# Altium schematic sheet RS-485.SchDoc
size 420 x 297 mm; DocumentNumber: АБВГ.123456.XXX Э3; SheetNumber: 4; SheetTotal: 4; PageSetup: Record=PageOptionsZCenterHorizontal=FalseZCenterVertical=FalseZPrintScale=0.95ZXCorrection=0.00ZYCorrection=0.00ZPrintKind=1ZBorderSize=5000000ZLeftOffset=0ZBottomOffset=0ZOrientation=1ZPaperLength=1000ZPaperWidth=1000ZScale=100ZPaperSource=15ZPrintQuality=600ZMediaType=1ZDitherType=10ZPaperKind=A4ZPrintScaleMode=1; DocumentCode: АБВГ.123456.XXX Э3
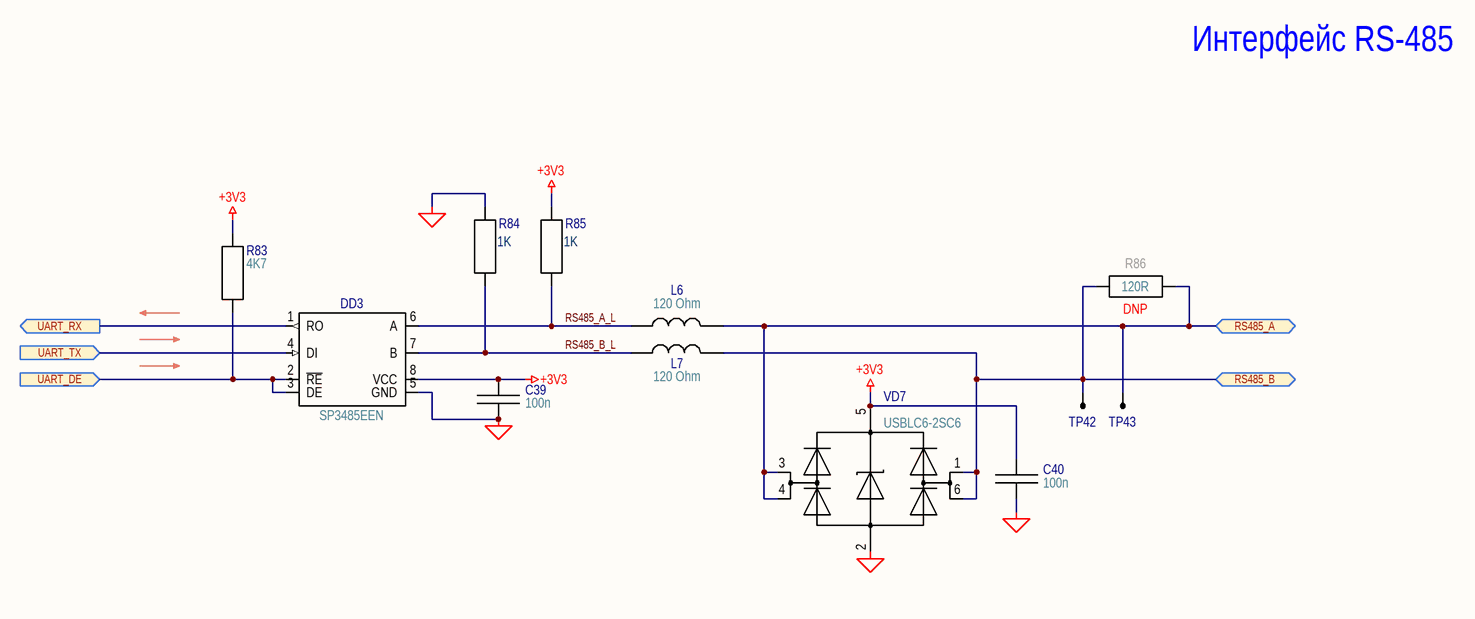
[diagram p0: RS-485.SchDoc]

## Parts
C39  100n  [C0402]
C40  100n  [C0402]
DD3  SP3485EEN  [SOP-8]
L6  120 Ohm  [BLM18PG]
L7  120 Ohm  [BLM18PG]
R83  4K7  [R0402]
R84  1K  [R0402]
R85  1K  [R0402]
R86  120R  [R0805_ROUNDED]  (no BOM)
TP42  TEST_POINT_1.27_STEP  [TEST_POINT_1.27_STEP]  (value not drawn)  (no BOM)
TP43  TEST_POINT_1.27_STEP  [TEST_POINT_1.27_STEP]  (value not drawn)  (no BOM)
VD7  USBLC6-2SC6  [SOT-23-6-USBLC-Internal-Jumpers]

## Ports
RS485_A (bidir, see Struct), RS485_B (bidir, see Struct), UART_DE (in, see Struct, MCU), UART_RX (out, see Struct, MCU), UART_TX (in, see Struct, MCU)

## Nets
+3V3: C39.2 C40.2 DD3.8(VCC) R83.2 R85.2 VD7.5
GND: C39.1 C40.1 DD3.5(GND) R84.2 VD7.2
RS485_A: L6.2 R86.2 TP43.1 VD7.3 VD7.4 ; port RS485_A
RS485_A_L: DD3.6(A) L6.1 R85.1
RS485_B: L7.2 R86.1 TP42.1 VD7.1 VD7.6 ; port RS485_B
RS485_B_L: DD3.7(B) L7.1 R84.1
UART_DE: DD3.2(~{RE}) DD3.3(DE) R83.1 ; port UART_DE
UART_RX: DD3.1(RO) ; port UART_RX
UART_TX: DD3.4(DI) ; port UART_TX

## Notes on the sheet
- Интерфейс RS-485
- (near R86) DNP
- Labels drawn without touching a wire or pin: =DocumentCode
- Подп. и дата
- Инв. № дубл.
- Взам. инв. №
- Инв. № подл.
- Лист
- Изм.
- № докум.
- Подп.
- Дата
- Копировал
- Формат А3

## Library data of the parts
C39 C40 = C0402: Чип-конденсатор 100 нФ 10% 50 В X7R 0402; Manufacturer Part Number: CC0402KRX7R9BB104; Manufacturer: Yageo; Value: 100 нФ 10% 50 В X7R; Component Type: Конденсатор
DD3 = SP3485EEN: Трансивер RS-485 SP3485EEN; Manufacturer: UMW; Manufacturer Part Number: SP3485EEN; Component Type: Микросхема
L6 L7 = BLM18PG121SN1D: Фильтр индуктивный 120 Ом @ 100 МГц 2 А 0603; Manufacturer: FENGHUA Advanced Technology; Manufacturer Part Number: CBM160808U121T; VALUE: 120 Ом @ 100 МГц 2 А; Component Type: Фильтр индуктивный
R83 = R0402: Чип-резистор 4,7 кОм 1% 0402; Manufacturer Part Number: RC0402FR-074K7L; Manufacturer: Yageo; Value: 4,7 кОм 1%; Component Type: Резистор
R84 R85 = R0402_4: Чип-резистор 1 кОм 1% 0402; Manufacturer Part Number: RC0402FR-071KL; Manufacturer: Yageo; Value: 1 кОм 1%; Component Type: Резистор
R86 = R0805: Чип-резистор 120 Ом 1% 0805; Manufacturer Part Number: RC0805FR-07120RL; Manufacturer: Yageo; TYPE: Чип-резистор 0805; Value: 120 Ом 1%; Component Type: Резистор
TP42 TP43 = TEST_POINT_1.27_STEP: Контрольная точка SMD
VD7 = USBLC6-2SC6: Диодная сборка ESD защиты USBLC6-2SC6; Manufacturer: UMW; Manufacturer Part Number: USBLC6-2SC6; Component Type: Сборка диодная